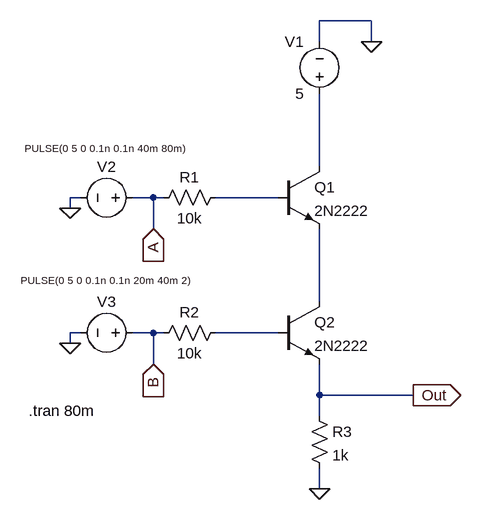
[diagram p0: schematic and_gate.asc]
and_gate.asc, the LTspice schematic file:
Version 4
SHEET 1 880 680
WIRE 432 -192 352 -192
WIRE 352 -160 352 -192
WIRE 432 -160 432 -192
WIRE 352 32 352 -80
WIRE -16 80 -32 80
WIRE 96 80 64 80
WIRE 112 80 96 80
WIRE 288 80 192 80
WIRE -32 96 -32 80
WIRE 96 128 96 80
WIRE 352 240 352 128
WIRE -16 288 -32 288
WIRE 96 288 64 288
WIRE 112 288 96 288
WIRE 288 288 192 288
WIRE -32 304 -32 288
WIRE 96 336 96 288
WIRE 352 384 352 336
WIRE 496 384 352 384
WIRE 352 416 352 384
WIRE 352 528 352 496
FLAG 352 528 0
FLAG 432 -160 0
FLAG -32 96 0
FLAG -32 304 0
FLAG 496 384 Out
IOPIN 496 384 Out
FLAG 96 128 A
IOPIN 96 128 In
FLAG 96 336 B
IOPIN 96 336 In
SYMBOL npn 288 32 R0
SYMATTR InstName Q1
SYMATTR Value 2N2222
SYMBOL npn 288 240 R0
SYMATTR InstName Q2
SYMATTR Value 2N2222
SYMBOL voltage 352 -64 R180
WINDOW 0 24 96 Left 2
WINDOW 3 24 16 Left 2
WINDOW 123 0 0 Left 0
WINDOW 39 0 0 Left 0
SYMATTR InstName V1
SYMATTR Value 5
SYMBOL res 208 64 R90
WINDOW 0 0 56 VBottom 2
WINDOW 3 32 56 VTop 2
SYMATTR InstName R1
SYMATTR Value 10k
SYMBOL res 208 272 R90
WINDOW 0 0 56 VBottom 2
WINDOW 3 32 56 VTop 2
SYMATTR InstName R2
SYMATTR Value 10k
SYMBOL voltage 80 80 R90
WINDOW 0 -32 56 VBottom 2
WINDOW 3 -86 61 VTop 1
WINDOW 123 0 0 Left 0
WINDOW 39 0 0 Left 0
SYMATTR InstName V2
SYMATTR Value PULSE(0 5 0 0.1n 0.1n 40m 80m)
SYMBOL voltage 80 288 R90
WINDOW 0 -32 56 VBottom 2
WINDOW 3 -91 60 VTop 1
WINDOW 123 0 0 Left 0
WINDOW 39 0 0 Left 0
SYMATTR InstName V3
SYMATTR Value PULSE(0 5 0 0.1n 0.1n 20m 40m 2)
SYMBOL res 336 400 R0
SYMATTR InstName R3
SYMATTR Value 1k
TEXT -96 408 Left 2 !.tran 80m

The netlist it stands for:
* and_gate.asc
Q1 N001 N002 N003 0 2N2222
Q2 N003 N004 Out 0 2N2222
V1 N001 0 5
R1 N002 A 10k
R2 N004 B 10k
V2 A 0 PULSE(0 5 0 0.1n 0.1n 40m 80m)
V3 B 0 PULSE(0 5 0 0.1n 0.1n 20m 40m 2)
R3 Out 0 1k
.model NPN NPN
.model PNP PNP
.lib standard.bjt
.tran 80m
.backanno
.end

* Results of the author's LTspice run, read from the files saved beside the schematic
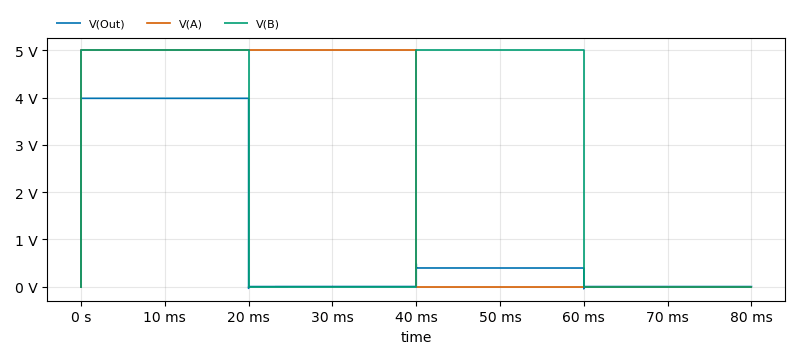
[diagram p1: Transient Analysis of and_gate.asc, plotted from the saved traces]
* Transient Analysis, 1 run:
*   V(Out): min -47.24 mV, max 3.999 V, average 1.095 V, rms 2.002 V, last 0 V
*   V(A): min 0 V, max 5 V, average 2.5 V, rms 3.536 V, last 0 V
*   V(B): min 0 V, max 5 V, average 2.5 V, rms 3.536 V, last 0 V